# Altium schematic sheet relay.SchDoc
size A4
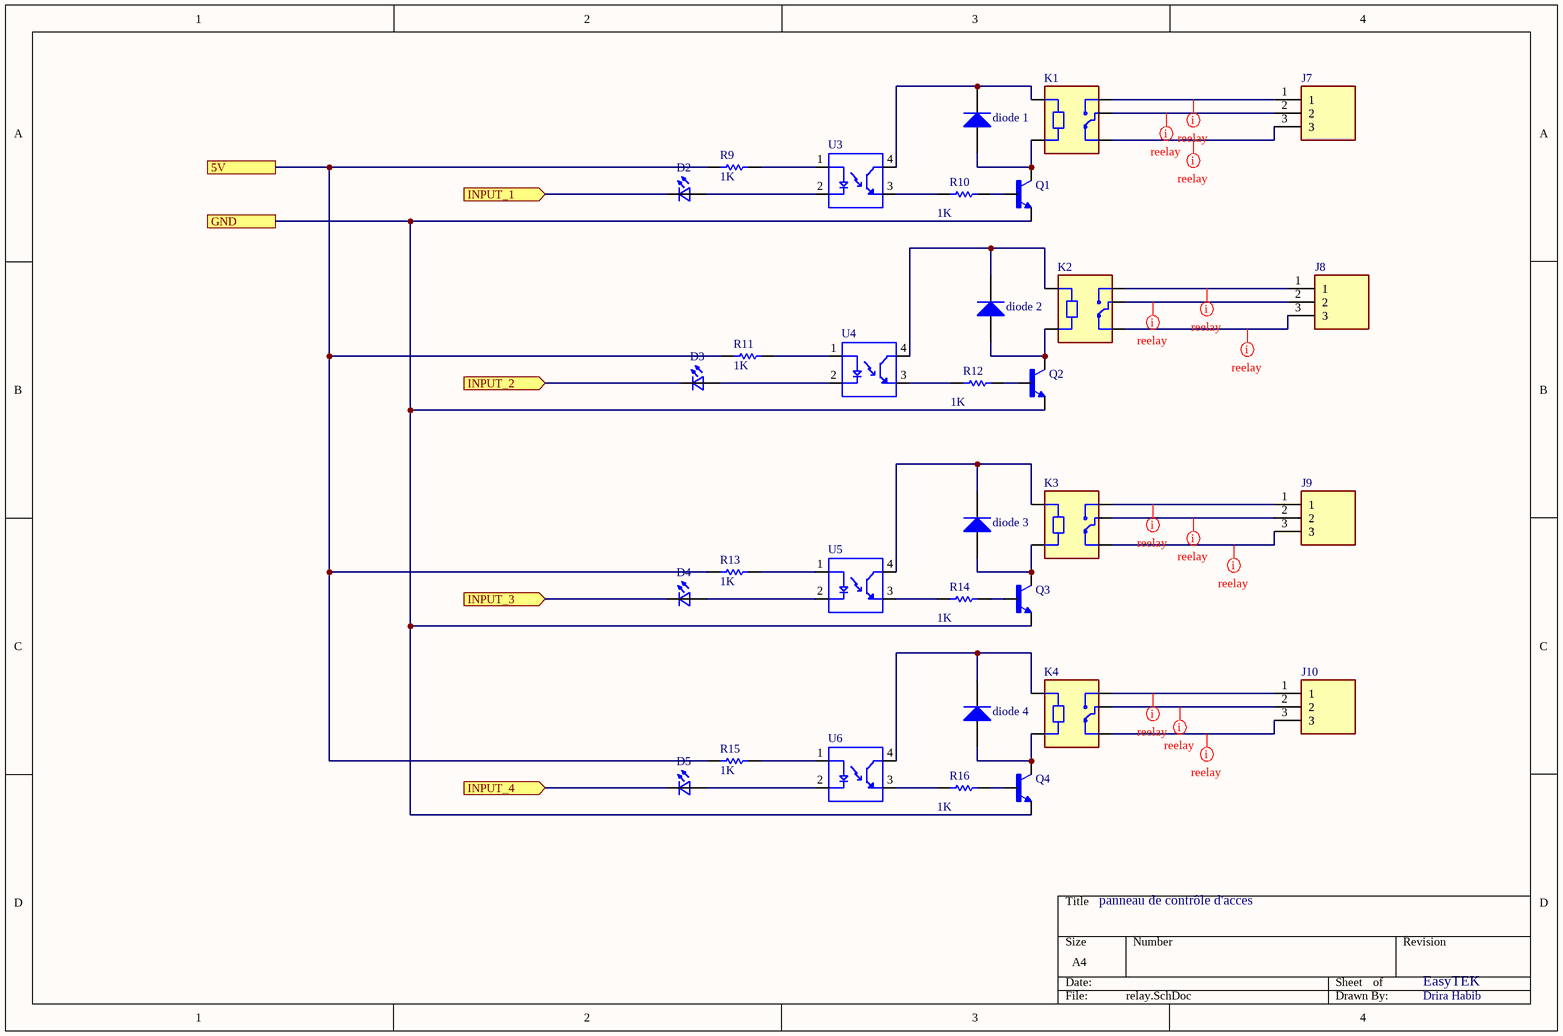
[diagram p0: relay.SchDoc]

## Parts
D2  LTST-C193TBKT-5A  [0603 - duplicate]  (value not drawn)
D3  LTST-C193TBKT-5A  [0603 - duplicate]  (value not drawn)
D4  LTST-C193TBKT-5A  [0603 - duplicate]  (value not drawn)
D5  LTST-C193TBKT-5A  [0603 - duplicate]  (value not drawn)
diode_1  Diode 1N4001  [DO-41]  (value not drawn)
diode_2  Diode 1N4003  [DO-41]  (value not drawn)
diode_3  Diode 1N4003  [DO-41]  (value not drawn)
diode_4  Diode 1N4003  [DO-41]  (value not drawn)
J7  TB006-508-03BE  [CUI_TB006-508-03BE]  (value not drawn)
J8  TB006-508-03BE  [CUI_TB006-508-03BE]  (value not drawn)
J9  TB006-508-03BE  [CUI_TB006-508-03BE]  (value not drawn)
J10  TB006-508-03BE  [CUI_TB006-508-03BE]  (value not drawn)
K1  SRD-05VDC-SL-C  [RELAY_SRD-05VDC-SL-C]  (value not drawn)
K2  SRD-05VDC-SL-C  [RELAY_SRD-05VDC-SL-C]  (value not drawn)
K3  SRD-05VDC-SL-C  [RELAY_SRD-05VDC-SL-C]  (value not drawn)
K4  SRD-05VDC-SL-C  [RELAY_SRD-05VDC-SL-C]  (value not drawn)
Q1  BCW31*  [SOT23-BEC]  (value not drawn)
Q2  BCW31*  [SOT23-BEC]  (value not drawn)
Q3  BCW31*  [SOT23-BEC]  (value not drawn)
Q4  BCW31*  [SOT23-BEC]  (value not drawn)
R9  value 1K  [R0603]  (hidden comment: Res1)
R10  value 1K  [R0603]  (hidden comment: Res1)
R11  value 1K  [R0603]  (hidden comment: Res1)
R12  value 1K  [R0603]  (hidden comment: Res1)
R13  value 1K  [R0603]  (hidden comment: Res1)
R14  value 1K  [R0603]  (hidden comment: Res1)
R15  value 1K  [R0603]  (hidden comment: Res1)
R16  value 1K  [R0603]  (hidden comment: Res1)
U3  LTV-817-A  [DIP762W50P254L510H500Q4]  (value not drawn)
U4  LTV-817-A  [DIP762W50P254L510H500Q4]  (value not drawn)
U5  LTV-817-A  [DIP762W50P254L510H500Q4]  (value not drawn)
U6  LTV-817-A  [DIP762W50P254L510H500Q4]  (value not drawn)

## Ports
5V, GND, INPUT_1 (in), INPUT_2 (in), INPUT_3 (in), INPUT_4 (in)

## Nets
5V: R9.2 R11.2 R13.2 R15.2 ; port 5V
GND: Q1.E Q2.E Q3.E Q4.E ; port GND
INPUT_1: D2.1(K2) ; port INPUT_1
INPUT_2: D3.1(K2) ; port INPUT_2
INPUT_3: D4.1(K2) ; port INPUT_3
INPUT_4: D5.1(K2) ; port INPUT_4
NetD2_2: D2.2(A2) U3.2(C)
NetD3_2: D3.2(A2) U4.2(C)
NetD4_2: D4.2(A2) U5.2(C)
NetD5_2: D5.2(A2) U6.2(C)
Netdiode_1_1: diode_1.1(A) K1.A2 Q1.C
Netdiode_1_2: diode_1.2(K) K1.A1 U3.4(CT)
Netdiode_2_1: diode_2.1(A) K2.A2 Q2.C
Netdiode_2_2: diode_2.2(K) K2.A1 U4.4(CT)
Netdiode_3_1: diode_3.1(A) K3.A2 Q3.C
Netdiode_3_2: diode_3.2(K) K3.A1 U5.4(CT)
Netdiode_4_1: diode_4.1(A) K4.A2 Q4.C
Netdiode_4_2: diode_4.2(K) K4.A1 U6.4(CT)
NetJ7_1: J7.1 K1.NO
NetJ7_2: J7.2 K1.COM
NetJ7_3: J7.3 K1.NC
NetJ8_1: J8.1 K2.NO
NetJ8_2: J8.2 K2.COM
NetJ8_3: J8.3 K2.NC
NetJ9_1: J9.1 K3.NO
NetJ9_2: J9.2 K3.COM
NetJ9_3: J9.3 K3.NC
NetJ10_1: J10.1 K4.NO
NetJ10_2: J10.2 K4.COM
NetJ10_3: J10.3 K4.NC
NetQ1_B: Q1.B R10.2
NetQ2_B: Q2.B R12.2
NetQ3_B: Q3.B R14.2
NetQ4_B: Q4.B R16.2
NetR9_1: R9.1 U3.1(A)
NetR10_1: R10.1 U3.3(ET)
NetR11_1: R11.1 U4.1(A)
NetR12_1: R12.1 U4.3(ET)
NetR13_1: R13.1 U5.1(A)
NetR14_1: R14.1 U5.3(ET)
NetR15_1: R15.1 U6.1(A)
NetR16_1: R16.1 U6.3(ET)

## Layout directives
net class realy: NetJ7_1, NetJ7_2, NetJ7_3, NetJ8_1, NetJ8_2, NetJ8_3, NetJ9_1, NetJ9_2, NetJ9_3, NetJ10_1, NetJ10_2, NetJ10_3

## Notes on the sheet
- panneau de contrôle d'acces
- EasyTEK
- Drira Habib

## Library data of the parts
D2-D5 = LTST-C193TBKT-5A: Blue 470nm LED Indication - Discrete 2.8V 0603 _1608 Metric_; MF: Lite-On Inc.; MP: LTST-C193TBKT-5A; Value: *; Digi-Key_Purchase_URL: https://www.digikey.com/product-detail/en/lite-on-inc/LTST-C193TBKT-5A/160-1827-1-ND/2355044?utm_source=snapeda&utm_medium=aggregator&utm_campaign=symbol; SnapEDA_Link: https://www.snapeda.com/parts/LTST-C193TBKT-5A/Lite-On%20Inc./view-part/350303/?ref=snap; Digi-Key_Part_Number: 160-1827-1-ND; Package: 0603 Lite-On
diode_1 = Diode 1N4001: 1 Amp General Purpose Rectifier; PackageReference: DO-41; PackageDescription: Diode, Axial; Body 5.2 x 2.7 mm (LxDia. max), Lead Dia. 0.86 mm (max); Published: 8-Jun-2000; LatestRevisionDate: 17-Jul-2002; LatestRevisionNote: Re-released for DXP Platform.; DatasheetVersion: 1998; PackageVersion: Aug-1999; Publisher: Altium Limited; Code_JEDEC: DO-204-AL; ComponentLink1Description: Manufacturer Link; ComponentLink1URL: http://www.fairchildsemi.com/; ComponentLink2Description: Datasheet; ComponentLink2URL: http://www.fairchildsemi.com/ds/1N%2F1N4001.pdf
diode_2-diode_4 = Diode 1N4003: 1 Amp General Purpose Rectifier; PackageReference: DO-41; PackageDescription: Diode, Axial; Body 5.2 x 2.7 mm (LxDia. max), Lead Dia. 0.86 mm (max)
J7-J10 = TB006-508-03BE: 2~24 Poles, Screw Type, Horizontal, 5.08 Pitch, 26~14 (AWG), Terminal Block Connector; MF: CUI Devices; Price: None; CUI_purchase_URL: https://www.cuidevices.com/product/interconnect/connectors/terminal-blocks/tb006-508-series?utm_source=snapeda.com&utm_medium=referral&utm_campaign=snapedaBOM; Purchase-URL: https://pricing.snapeda.com/search/part/TB006-508-03BE/?ref=eda; MP: TB006-508-03BE; Value: *; Package: None; SnapEDA_Link: https://www.snapeda.com/parts/TB006-508-03BE/CUI+Devices/view-part/?ref=snap; Availability: In Stock; Check_prices: https://www.snapeda.com/parts/TB006-508-03BE/CUI+Devices/view-part/?ref=eda
K1-K4 = SRD-05VDC-SL-C: 5V Trigger Relay Module For Arduino And Raspberry Pi 5V Trigger Relay Module For Arduino And Raspberry Pi; MF: Songle Relay; Check_prices: https://www.snapeda.com/parts/SRD-05VDC-SL-C/Songle+Relay/view-part/?ref=eda; Value: *; Availability: Not in stock; Price: None; Package: NON STANDARD-5 Songle Relay; MP: SRD-05VDC-SL-C; SnapEDA_Link: https://www.snapeda.com/parts/SRD-05VDC-SL-C/Songle+Relay/view-part/?ref=snap
Q1-Q4 = BCW31*: â€¢ This device is designed for general purpose amplifier applications at collector currents to 300 mA. â€¢ Sourced from process 10.; MF: Fairchild Semiconductor; MP: BCW31; Check_prices: https://www.snapeda.com/parts/BCW31/Fairchild+Semiconductor/view-part/?ref=eda; Purchase-URL: https://pricing.snapeda.com/search/part/BCW31/?ref=eda; Price: None; SnapEDA_Link: https://www.snapeda.com/parts/BCW31/Fairchild+Semiconductor/view-part/?ref=snap; Availability: In Stock; Package: SOT-23 ON; Value: *
R9-R16 = Res1: Resistor; PackageReference: AXIAL-0.3; PackageDescription: Axial Device, Thru-Hole; 2 Leads; 0.3 in Pin Spacing
U3-U6 = LTV-817-A: Optoisolator Transistor Output 5000Vrms 1 Channel 4-DIP; MF: Lite-On Inc.; MP: LTV-817-A; Package: DIP-4 Lite-On Inc.; Digi-Key_Part_Number: 160-2037-5-ND; SnapEDA_Link: https://www.snapeda.com/parts/LTV-817-A/Lite-On%20Inc./view-part/3215369/?ref=snap; Value: *; Digi-Key_Purchase_URL: https://www.digikey.bg/product-detail/en/lite-on-inc/LTV-817-A/160-2037-5-ND/3199509?utm_source=snapeda&utm_medium=aggregator&utm_campaign=symbol